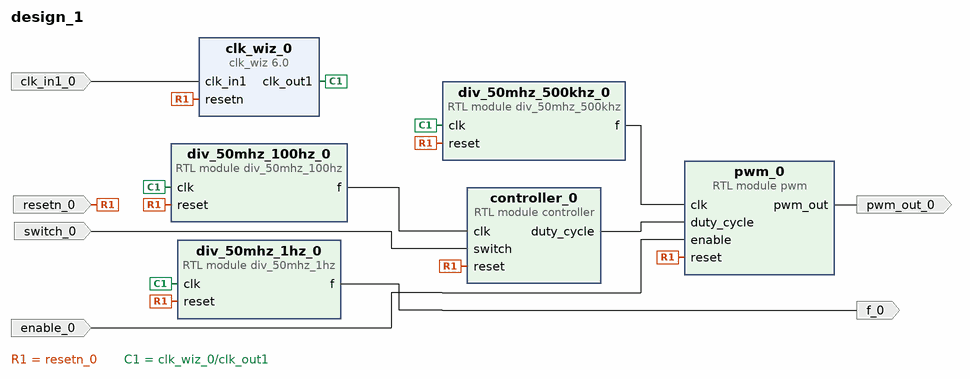
[diagram p0: block diagram of the top level]
# Vivado block design design_1, xc7z010clg400-1, Vivado 2019.1
create_bd_design design_1

create_bd_port -dir I enable_0
create_bd_port -dir O pwm_out_0
create_bd_port -dir I -type clk clk_in1_0
set_property -dict {CONFIG.FREQ_HZ 33333300} [get_bd_ports clk_in1_0]
create_bd_port -dir I -type rst resetn_0
create_bd_port -dir O f_0
create_bd_port -dir I switch_0

create_bd_cell -type module -reference div_50mhz_500khz div_50mhz_500khz_0
create_bd_cell -type ip -vlnv xilinx.com:ip:clk_wiz:6.0 clk_wiz_0
set_property -dict [list \
  CONFIG.CLKIN1_JITTER_PS 300.0 \
  CONFIG.CLKOUT1_DRIVES BUFG \
  CONFIG.CLKOUT1_JITTER 241.121 \
  CONFIG.CLKOUT1_PHASE_ERROR 204.117 \
  CONFIG.CLKOUT1_REQUESTED_OUT_FREQ 50.000 \
  CONFIG.CLKOUT2_DRIVES BUFG \
  CONFIG.CLKOUT3_DRIVES BUFG \
  CONFIG.CLKOUT4_DRIVES BUFG \
  CONFIG.CLKOUT5_DRIVES BUFG \
  CONFIG.CLKOUT6_DRIVES BUFG \
  CONFIG.CLKOUT7_DRIVES BUFG \
  CONFIG.CLK_IN1_BOARD_INTERFACE Custom \
  CONFIG.FEEDBACK_SOURCE FDBK_AUTO \
  CONFIG.MMCM_BANDWIDTH OPTIMIZED \
  CONFIG.MMCM_CLKFBOUT_MULT_F 30.000 \
  CONFIG.MMCM_CLKIN1_PERIOD 30.000 \
  CONFIG.MMCM_CLKIN2_PERIOD 10.0 \
  CONFIG.MMCM_CLKOUT0_DIVIDE_F 20.000 \
  CONFIG.MMCM_COMPENSATION ZHOLD \
  CONFIG.MMCM_DIVCLK_DIVIDE 1 \
  CONFIG.PRIMITIVE MMCM \
  CONFIG.PRIM_IN_FREQ 33.3333 \
  CONFIG.RESET_PORT resetn \
  CONFIG.RESET_TYPE ACTIVE_LOW \
  CONFIG.USE_LOCKED false \
] [get_bd_cells clk_wiz_0]
create_bd_cell -type module -reference div_50mhz_1hz div_50mhz_1hz_0
create_bd_cell -type module -reference pwm pwm_0
create_bd_cell -type module -reference div_50mhz_100hz div_50mhz_100hz_0
create_bd_cell -type module -reference controller controller_0

# ---- connections ----

connect_bd_net [get_bd_pins div_50mhz_500khz_0/f] [get_bd_pins pwm_0/clk]
connect_bd_net [get_bd_pins controller_0/duty_cycle] [get_bd_pins pwm_0/duty_cycle]
connect_bd_net -net enable_0_1 [get_bd_ports enable_0] [get_bd_pins pwm_0/enable]
connect_bd_net [get_bd_pins pwm_0/pwm_out] [get_bd_ports pwm_out_0]
connect_bd_net -net clk_in1_0_1 [get_bd_ports clk_in1_0] [get_bd_pins clk_wiz_0/clk_in1]
connect_bd_net -net resetn_0_1 [get_bd_ports resetn_0] \
  [get_bd_pins clk_wiz_0/resetn] [get_bd_pins div_50mhz_500khz_0/reset] [get_bd_pins div_50mhz_1hz_0/reset] \
  [get_bd_pins pwm_0/reset] [get_bd_pins div_50mhz_100hz_0/reset] [get_bd_pins controller_0/reset]
connect_bd_net [get_bd_pins div_50mhz_1hz_0/f] [get_bd_ports f_0]
connect_bd_net -net switch_0_1 [get_bd_ports switch_0] [get_bd_pins controller_0/switch]
connect_bd_net [get_bd_pins clk_wiz_0/clk_out1] \
  [get_bd_pins div_50mhz_500khz_0/clk] [get_bd_pins div_50mhz_1hz_0/clk] [get_bd_pins div_50mhz_100hz_0/clk]
connect_bd_net [get_bd_pins div_50mhz_100hz_0/f] [get_bd_pins controller_0/clk]

validate_bd_design
save_bd_design
